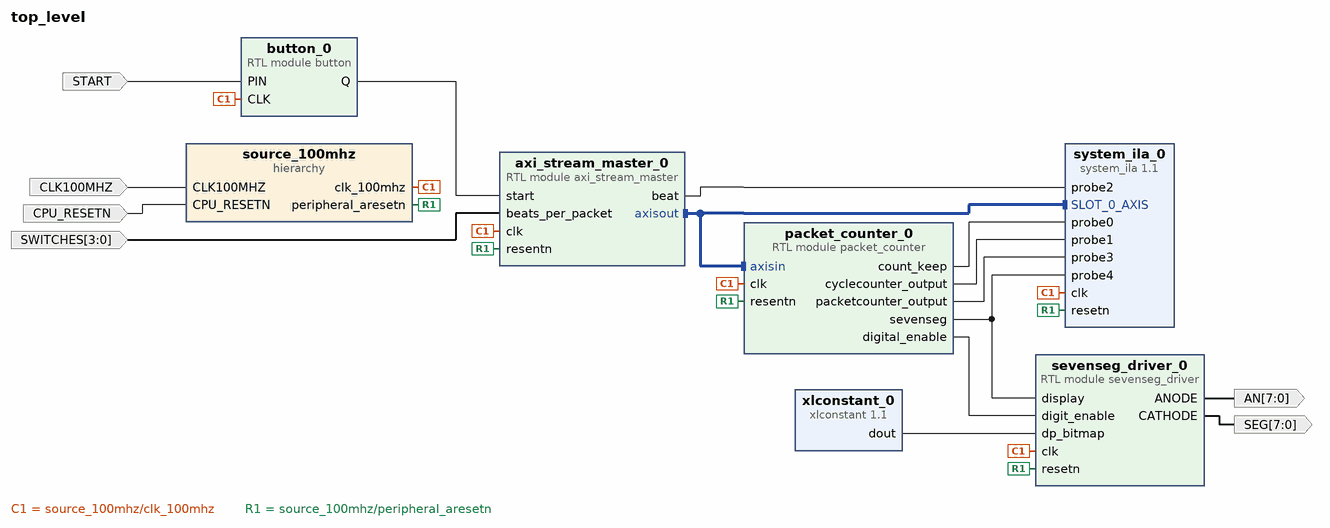
[diagram p0: block diagram of the top level]
# Vivado block design top_level, xc7a100tcsg324-1, Vivado 2021.1.1
create_bd_design top_level

create_bd_port -dir I -type rst CPU_RESETN
create_bd_port -dir I -type clk CLK100MHZ
create_bd_port -dir I START
create_bd_port -dir I -from 3 -to 0 SWITCHES
create_bd_port -dir O -from 7 -to 0 AN
create_bd_port -dir O -from 7 -to 0 SEG

create_bd_cell -type module -reference button button_0
create_bd_cell -type hier source_100mhz
create_bd_cell -type module -reference sevenseg_driver sevenseg_driver_0
create_bd_cell -type ip -vlnv xilinx.com:ip:xlconstant:1.1 xlconstant_0
set_property -dict {CONFIG.CONST_VAL 0b00000000 CONFIG.CONST_WIDTH 8} [get_bd_cells xlconstant_0]
create_bd_cell -type ip -vlnv xilinx.com:ip:system_ila:1.1 system_ila_0
set_property -dict [list \
  CONFIG.C_MON_TYPE MIX \
  CONFIG.C_NUM_OF_PROBES 5 \
  CONFIG.C_SLOT_0_INTF_TYPE xilinx.com:interface:axis_rtl:1.0 \
] [get_bd_cells system_ila_0]
create_bd_cell -type module -reference axi_stream_master axi_stream_master_0
create_bd_cell -type module -reference packet_counter packet_counter_0

# ---- hierarchy /source_100mhz ----
current_bd_instance /source_100mhz
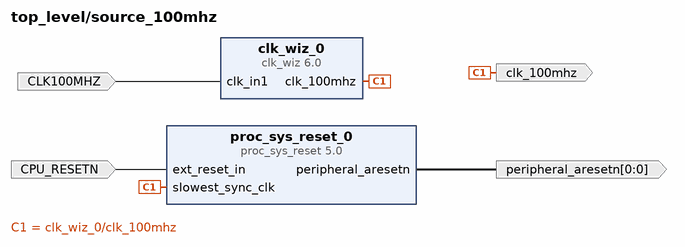
[diagram p1: block diagram inside /source_100mhz]
create_bd_pin -dir O -type clk clk_100mhz
create_bd_pin -dir I -type rst CPU_RESETN
create_bd_pin -dir I -type clk CLK100MHZ
create_bd_pin -dir O -from 0 -to 0 -type rst peripheral_aresetn

create_bd_cell -type ip -vlnv xilinx.com:ip:proc_sys_reset:5.0 proc_sys_reset_0
create_bd_cell -type ip -vlnv xilinx.com:ip:clk_wiz:6.0 clk_wiz_0
set_property -dict {CONFIG.CLK_OUT1_PORT clk_100mhz CONFIG.USE_LOCKED false CONFIG.USE_RESET false} [get_bd_cells clk_wiz_0]

# ---- connections ----

current_bd_instance /source_100mhz
connect_bd_net -net clk_in1_0_1 [get_bd_pins CLK100MHZ] [get_bd_pins clk_wiz_0/clk_in1]
connect_bd_net [get_bd_pins clk_wiz_0/clk_100mhz] [get_bd_pins clk_100mhz] [get_bd_pins proc_sys_reset_0/slowest_sync_clk]
connect_bd_net -net ext_reset_in_0_1 [get_bd_pins CPU_RESETN] [get_bd_pins proc_sys_reset_0/ext_reset_in]
connect_bd_net [get_bd_pins proc_sys_reset_0/peripheral_aresetn] [get_bd_pins peripheral_aresetn]

current_bd_instance /
connect_bd_intf_net [get_bd_intf_pins packet_counter_0/axisin] [get_bd_intf_pins axi_stream_master_0/axisout]
connect_bd_intf_net [get_bd_intf_pins packet_counter_0/axisin] [get_bd_intf_pins system_ila_0/SLOT_0_AXIS]
connect_bd_net -net PIN_0_1 [get_bd_ports START] [get_bd_pins button_0/PIN]
connect_bd_net [get_bd_pins axi_stream_master_0/beat] [get_bd_pins system_ila_0/probe2]
connect_bd_net [get_bd_pins button_0/Q] [get_bd_pins axi_stream_master_0/start]
connect_bd_net -net clk_in1_0_1 [get_bd_ports CLK100MHZ] [get_bd_pins source_100mhz/CLK100MHZ]
connect_bd_net -net clk_wiz_0_clk_100mhz [get_bd_pins source_100mhz/clk_100mhz] \
  [get_bd_pins button_0/CLK] [get_bd_pins sevenseg_driver_0/clk] [get_bd_pins system_ila_0/clk] \
  [get_bd_pins axi_stream_master_0/clk] [get_bd_pins packet_counter_0/clk]
connect_bd_net -net ext_reset_in_0_1 [get_bd_ports CPU_RESETN] [get_bd_pins source_100mhz/CPU_RESETN]
connect_bd_net [get_bd_pins packet_counter_0/count_keep] [get_bd_pins system_ila_0/probe0]
connect_bd_net [get_bd_pins packet_counter_0/cyclecounter_output] [get_bd_pins system_ila_0/probe1]
connect_bd_net [get_bd_pins packet_counter_0/digital_enable] [get_bd_pins sevenseg_driver_0/digit_enable]
connect_bd_net [get_bd_pins packet_counter_0/packetcounter_output] [get_bd_pins system_ila_0/probe3]
connect_bd_net [get_bd_pins packet_counter_0/sevenseg] [get_bd_pins sevenseg_driver_0/display] [get_bd_pins system_ila_0/probe4]
connect_bd_net -net packet_size_0_1 [get_bd_ports SWITCHES] [get_bd_pins axi_stream_master_0/beats_per_packet]
connect_bd_net [get_bd_pins sevenseg_driver_0/ANODE] [get_bd_ports AN]
connect_bd_net [get_bd_pins sevenseg_driver_0/CATHODE] [get_bd_ports SEG]
connect_bd_net [get_bd_pins source_100mhz/peripheral_aresetn] \
  [get_bd_pins sevenseg_driver_0/resetn] [get_bd_pins system_ila_0/resetn] [get_bd_pins axi_stream_master_0/resentn] \
  [get_bd_pins packet_counter_0/resentn]
connect_bd_net [get_bd_pins xlconstant_0/dout] [get_bd_pins sevenseg_driver_0/dp_bitmap]

validate_bd_design
save_bd_design
